# EAGLE design 4 ch sample-and-hold without mux v1.0 (EAGLE 9.5.2)
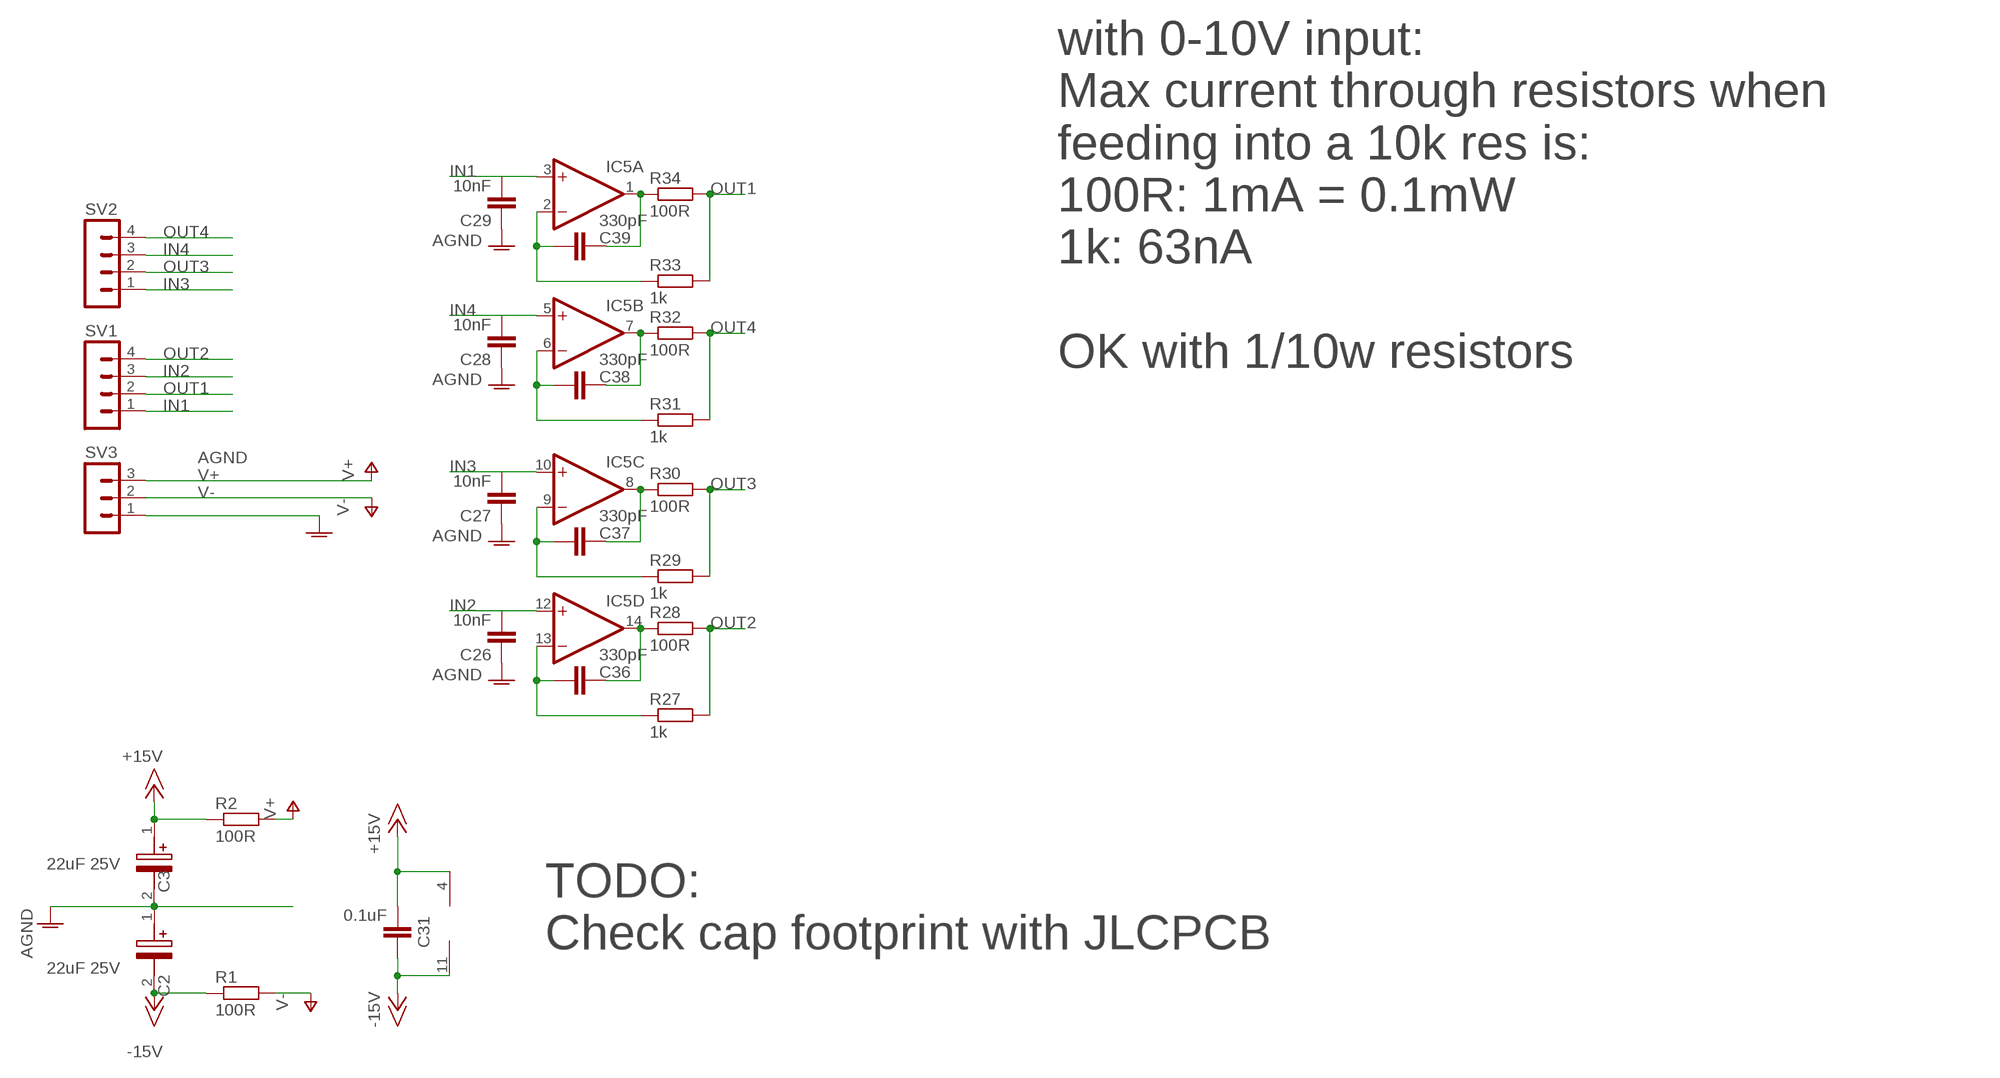
[diagram p0: schematic, sheet 1]

## Parts
C2  22uF 25V  VZL101M1CTR-0606  [CAPAE660X610N]
C3  22uF 25V  VZL101M1CTR-0606  [CAPAE660X610N]
C26  10nF  C-EUC0805  [C0805]
C27  10nF  C-EUC0805  [C0805]
C28  10nF  C-EUC0805  [C0805]
C29  10nF  C-EUC0805  [C0805]
C31  0.1uF  C-EUC0603  [C0603]
C36  330pF  C-EUC0603  [C0603]
C37  330pF  C-EUC0603  [C0603]
C38  330pF  C-EUC0603  [C0603]
C39  330pF  C-EUC0603  [C0603]
IC5  TL074D  [SO14]
R1  100R  R-EU_R0805  [R0805]
R2  100R  R-EU_R0805  [R0805]
R27  1k  R-EU_R0603  [R0603]
R28  100R  R-EU_R0603  [R0603]
R29  1k  R-EU_R0603  [R0603]
R30  100R  R-EU_R0603  [R0603]
R31  1k  R-EU_R0603  [R0603]
R32  100R  R-EU_R0603  [R0603]
R33  1k  R-EU_R0603  [R0603]
R34  100R  R-EU_R0603  [R0603]
SV1  MA04-1JP  [SIP-PIN04-1J]
SV2  MA04-1JP  [SIP-PIN04-1J]
SV3  MA03-1JP  [SIP-PIN03-1J]

## Nets
+15V: C3.1(+) C31.1 IC5.4(P:V+) R2.1
-15V: C2.2(-) C31.2 IC5.11(P:V-) R1.1
AGND: C2.1(+) C3.2(-) C26.1 C27.1 C28.1 C29.1 SV3.1
IN1: C29.2 IC5.3(A:+IN) SV1.1
IN2: C26.2 IC5.12(D:+IN) SV1.3
IN3: C27.2 IC5.10(C:+IN) SV2.1
IN4: C28.2 IC5.5(B:+IN) SV2.3
N$33: C39.1 IC5.1(A:OUT) R34.1
N$34: C39.2 IC5.2(A:-IN) R33.1
N$35: C38.1 IC5.7(B:OUT) R32.1
N$36: C38.2 IC5.6(B:-IN) R31.1
N$37: C37.1 IC5.8(C:OUT) R30.1
N$38: C36.1 IC5.14(D:OUT) R28.1
N$39: C37.2 IC5.9(C:-IN) R29.1
N$40: C36.2 IC5.13(D:-IN) R27.1
OUT1: R33.2 R34.2 SV1.2
OUT2: R27.2 R28.2 SV1.4
OUT3: R29.2 R30.2 SV2.2
OUT4: R31.2 R32.2 SV2.4
V+: R2.2 SV3.3
V-: R1.2 SV3.2

## Notes on the sheet
- with 0-10V input:
  Max current through resistors when
  feeding into a 10k res is:
  100R: 1mA = 0.1mW
  1k: 63nA
  
  OK with 1/10w resistors
- TODO: 
  Check cap footprint with JLCPCB

## Library data of the parts
C2 C3 = joakim-jclpcb:VZL101M1CTR-0606: Aluminum Electrolytic Capacitors - SMD 100uF 16 Volts 20% Source: Datasheet <https://www.mouser.com/datasheet/2/231/151002386372-1222327.pdf>; DESCRIPTION: Aluminum Electrolytic Capacitors - SMD 100uF 16 Volts 20%; HEIGHT: 6.1mm; MANUFACTURER_NAME: Lelon; MANUFACTURER_PART_NUMBER: VZL101M1CTR-0606; MOUSER_PART_NUMBER: 140-VZL101M1CTR-0606; MOUSER_PRICE-STOCK: https://www.mouser.com/Search/Refine.aspx?Keyword=140-VZL101M1CTR-0606
C26-C29 = rcl:C-EU: CAPACITOR, European symbol; SPICEPREFIX: C
C31 C36-C39 = resistor:C-EU: CAPACITOR, European symbol
IC5 = linear:TL074: OP AMP
R1 R2 = rcl:R-EU_: RESISTOR, European symbol; SPICEPREFIX: R
R27-R34 = resistor:R-EU_: RESISTOR, European symbol
SV1 SV2 = joakim:MA04-1J: PIN HEADER
SV3 = joakim:MA03-1J: PIN HEADER

## Board
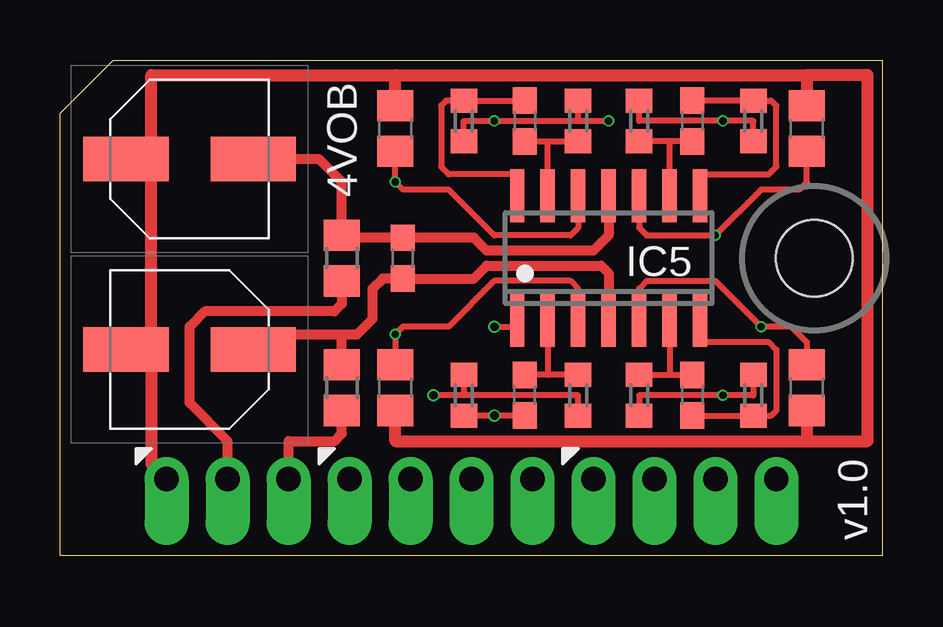
[diagram p1: board, top side]
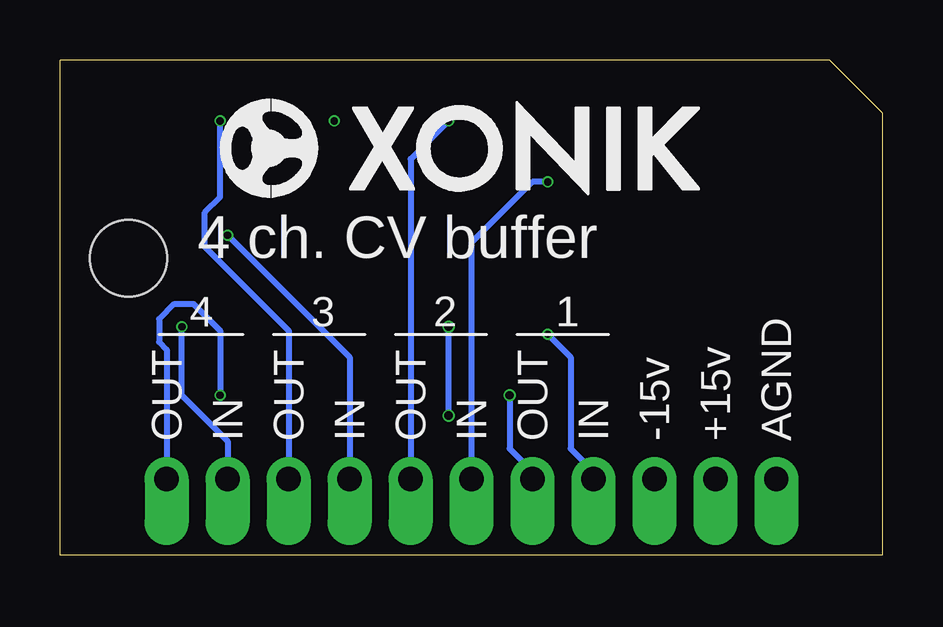
[diagram p2: board, bottom side, seen from below]

Size 34.29 x 20.64 mm. Coordinates in mm from the lower left corner, seen from the top.
Outline: 0,0 34.29,0 34.29,20.64 2.22,20.64 0,18.41 0,0
Copper layers (1*16): Top 0.035mm / dielectric 1.6mm / Bottom 0.035mm
Design rules "jlcpcb-2layers": minimum track width 5mil, minimum drill 0.3mm, track to track 5mil, track to pad 5mil, pad to pad 5mil, via to via 5mil, smd to smd 5mil, copper to edge 0.2mm, drill to drill 6mil, minimum pad ring 10mil, minimum via ring 3mil, stop-mask expansion 4mil, vias tented up to drill 0mil, thermal gap 10mil
Holes 3.2 mm at 31.43,12.38

### Footprints (pad centres in the part's own frame; a part is rotated, then mirrored left to right if it is on the bottom)
CAPAE660X610N = smd 3.55 x 1.85: 1 -2.65,0; 2 2.65,0
C0805 = smd 1.3 x 1.5: 1 -0.95,0; 2 0.95,0
C0603 = smd 1.1 x 1: 1 -0.85,0; 2 0.85,0
SO14 = smd 0.6 x 2.2: 1 -3.81,-2.6; 2 -2.54,-2.6; 3 -1.27,-2.6; 4 0,-2.6; 5 1.27,-2.6; 6 2.54,-2.6; 7 3.81,-2.6; 8 3.81,2.6; 9 2.54,2.6; 10 1.27,2.6; 11 0,2.6; 12 -1.27,2.6; 13 -2.54,2.6; 14 -3.81,2.6
R0805 = smd 1.3 x 1.5: 1 -0.95,0; 2 0.95,0
R0603 = smd 1 x 1.1: 1 -0.85,0; 2 0.85,0
SIP-PIN04-1J = drill 1.016 offset: 1 -3.81,0; 2 -1.27,0; 3 1.27,0; 4 3.81,0
SIP-PIN03-1J = drill 1.016 offset: 1 -2.54,0; 2 0,0; 3 2.54,0

### Placement (x,y rotation side)
C2  5.4,16.51 0 top
C3  5.4,8.57 180 top
C26  13.97,17.78 270 top
C27  31.12,17.78 270 top
C28  31.12,6.99 90 top
C29  13.97,6.99 90 top
C31  14.29,12.38 90 top
C36  19.37,18.1 270 top
C37  26.35,18.1 270 top
C38  26.35,6.67 90 top
C39  19.37,6.67 90 top
IC5  22.86,12.38 0 top
R1  11.75,12.38 270 top
R2  11.75,6.99 270 top
R27  21.59,18.1 90 top
R28  16.83,18.1 270 top
R29  24.13,18.1 90 top
R30  28.89,18.1 270 top
R31  24.13,6.67 270 top
R32  28.89,6.67 90 top
R33  21.59,6.67 270 top
R34  16.83,6.67 90 top
SV1  15.88,3.17 0 top
SV2  26.04,3.17 0 top
SV3  6.99,3.17 0 top
U$1  [XONIK_LOGO_20]  27.62,14.92 0 bottom

### Tracks (layer width: path | path; a pad name or v marks a point on that pad's centre or on a via)
+15V
  Top 0.406: C3.1 8.68,9.21 11.75,9.21 | 11.75,9.21 12.38,9.21 13.02,9.84 13.02,11.11 13.44,11.53 C31.1 17.25,11.53 17.78,12.06 22.54,12.06 22.86,11.75 IC5.4 | R2.1 11.75,9.21
-15V
  Top 0.406: C2.2 10.8,16.51 11.75,15.56 R1.1 11.85,13.23 C31.2 17.25,13.23 17.78,12.7 22.23,12.7 22.86,13.34 IC5.11
AGND
  Top 0.406: C3.2 3.81,8.57 | C2.1 3.81,16.51
  Top 0.508: C28.1 31.12,4.76 | 31.12,4.76 13.97,4.76 C29.1 | SV3.1 3.81,3.81 3.81,8.57 3.81,16.51 3.81,20 13.97,20 | 13.97,20 31.12,20 | 31.12,20 C27.1 | 31.12,4.76 33.66,4.76 33.66,20 31.12,20 | C26.1 13.97,20
IN1  (via drill 0.3)
  Top 0.254: IC5.3 21.59,11.11 21.27,11.43 18.1,11.43 16.19,9.53 14.29,9.53 v13.97,9.21 C29.2
  Bottom 0.254: SV1.1 12.07,3.49 13.02,4.45 13.02,8.26 v13.97,9.21
IN2  (via drill 0.3)
  Top 0.254: IC5.12 21.59,13.65 21.27,13.34 18.1,13.34 16.19,15.24 14.29,15.24 v13.97,15.56 C26.2
  Bottom 0.254: SV1.3 17.14,13.02 14.61,15.56 v13.97,15.56
IN3  (via drill 0.3)
  Top 0.254: IC5.10 24.13,13.65 24.45,13.34 v27.3,13.34 29.21,15.24 30.8,15.24 31.12,15.56 C27.2
  Bottom 0.254: SV2.1 22.23,8.26 v27.3,13.34
IN4  (via drill 0.3)
  Top 0.254: IC5.5 24.13,11.11 24.45,11.43 27.3,11.43 v29.21,9.53 30.48,9.53 31.12,8.89 C28.2
  Bottom 0.254: SV2.3 27.3,4.76 29.21,6.67 v29.21,9.53
N$33  (via drill 0.35)
  Top 0.254: IC5.1 19.05,9.53 v18.1,9.53 | C39.1 v18.1,5.82 R34.1
  Bottom 0.254: v18.1,5.82 v18.1,9.53
N$34
  Top 0.254: C39.2 R33.1 20.32,7.52 IC5.2
N$35
  Top 0.254: C38.1 R32.1 29.63,5.82 29.84,6.03 29.84,8.57 29.53,8.89 26.67,8.89 IC5.7
N$36
  Top 0.254: R31.1 C38.2 25.4,7.52 IC5.6
N$37
  Top 0.254: C37.1 R30.1 29.63,18.95 29.84,18.73 29.84,16.19 29.53,15.88 26.67,15.88 IC5.8
N$38
  Top 0.254: C36.1 R28.1 16.09,18.95 15.88,18.73 15.88,16.19 16.19,15.88 19.05,15.88 IC5.14
N$39
  Top 0.254: R29.1 C37.2 25.4,17.25 IC5.9
N$40
  Top 0.254: C36.2 R27.1 20.32,17.25 IC5.13
OUT1  (via drill 0.35)
  Top 0.254: R33.2 21.59,6.67 16.83,6.67 | 16.83,6.67 v15.56,6.67 | R34.2 16.83,6.67
  Bottom 0.254: v15.56,6.67 15.56,4.45 14.61,3.49 SV1.2
OUT2  (via drill 0.3)
  Top 0.254: R28.2 16.83,18.1 v18.1,18.1 21.59,18.1 | 21.59,18.1 R27.2 | 21.59,18.1 v22.86,18.1
  Bottom 0.254: SV1.4 19.69,16.51 v18.1,18.1
OUT3  (via drill 0.3)
  Top 0.254: R29.2 24.13,18.1 v27.62,18.1 28.89,18.1 R30.2
  Bottom 0.254: SV2.2 24.77,9.37 28.26,12.86 28.26,14.29 27.62,14.92 v27.62,18.1
OUT4  (via drill 0.3)
  Top 0.254: R31.2 24.13,6.67 v27.62,6.67 28.89,6.67 R32.2
  Bottom 0.254: SV2.4 29.84,8.57 30.16,8.89 30.16,9.84 29.53,10.48 28.73,10.48 27.62,9.37 v27.62,6.67
V+
  Top 0.406: SV3.3 9.52,4.76 11.43,4.76 11.75,5.08 R2.2
V-
  Top 0.406: SV3.2 6.99,4.76 5.4,6.35 5.4,9.53 6.03,10.16 11.43,10.16 11.75,10.48 R1.2

### Text on the board
tNames: 4VOB | v1.0
bNames: 4 ch. CV buffer | 1 | 2 | 3 | 4 | AGND | +15v | -15v | IN | OUT | IN | OUT | IN | OUT | IN | OUT